# Altium schematic sheet Sheet1.SchDoc
size A; SheetNumber: 1; SheetTotal: 1
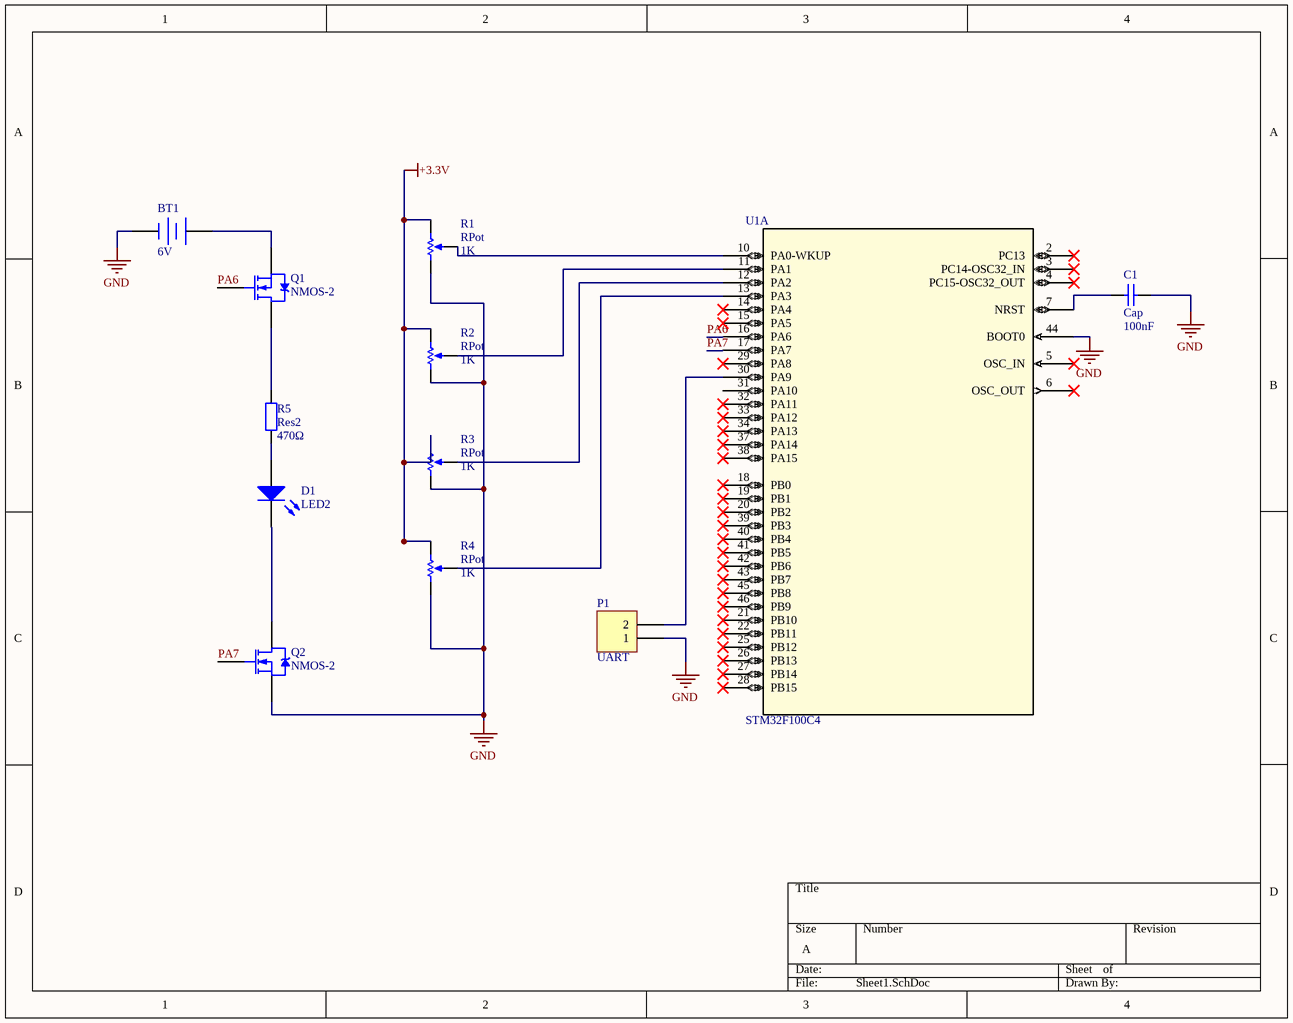
[diagram p0: Sheet1.SchDoc]

## Parts
BT1  6V  [BAT-2]
C1  Cap  value 100nF  [RAD-0.3]
D1  LED2  [3.2X1.6X1.1]
P1  UART  [HDR1X2]
Q1  NMOS-2  [TO-220AB]
Q2  NMOS-2  [TO-220AB]
R1  RPot  value 1K  [VR5]
R2  RPot  value 1K  [VR5]
R3  RPot  value 1K  [VR5]
R4  RPot  value 1K  [VR5]
R5  Res2  value 470Ω  [AXIAL-0.4]
U1  STM32F100C4  [LQFP48-7x7mm]  (part A of 2)

## Nets
+3.3V: R1.2(BOT) R2.2(BOT) R3.2(BOT) R4.2(BOT)
GND: BT1.2(-) C1.2 P1.1 Q2.3(S) R1.1(TOP) R2.1(TOP) R3.1(TOP) R4.1(TOP) U1.44(BOOT0)
PA6: Q1.1(G) U1.16(PA6)
PA7: Q2.1(G) U1.17(PA7)
NetBT1_1: BT1.1(+) Q1.3(S)
NetC1_1: C1.1 U1.7(NRST)
NetD1_1: D1.1(A) R5.1
NetD1_2: D1.2(K) Q2.2(D)
NetP1_2: P1.2 U1.30(PA9)
NetQ1_2: Q1.2(D) R5.2
NetR1_3: R1.3(TAP) U1.10(PA0-WKUP)
NetR2_3: R2.3(TAP) U1.11(PA1)
NetR3_3: R3.3(TAP) U1.12(PA2)
NetR4_3: R4.3(TAP) U1.13(PA3)

Not connected (* = marked no-connect by the designer): U1 2(PC13)* 3(PC14-OSC32_IN)* 4(PC15-OSC32_OUT)* 5(OSC_IN)* 6(OSC_OUT)* 14(PA4)* 15(PA5)* 18(PB0)* 19(PB1)* 20(PB2)* 21(PB10)* 22(PB11)* 25(PB12)* 26(PB13)* 27(PB14)* 28(PB15)* 29(PA8)* 31(PA10) 32(PA11)* 33(PA12)* 34(PA13)* 37(PA14)* 38(PA15)* 39(PB3)* 40(PB4)* 41(PB5)* 42(PB6)* 43(PB7)* 45(PB8)* 46(PB9)*

## Library data of the parts
BT1 = Battery: Multicell Battery; Published: 24-Mar-1999; LatestRevisionDate: 17-Jul-2002; LatestRevisionNote: Re-released for DXP Platform.; PackageReference: BAT-2; Publisher: Altium Limited; PackageDescription: Battery; 2 Leads
C1 = Cap: Capacitor; Published: 8-Jun-2000; LatestRevisionDate: 17-Jul-2002; LatestRevisionNote: Re-released for DXP Platform.; PackageReference: RAD-0.3; Publisher: Altium Limited; PackageDescription: Radial Cap, Thru-Hole; 2 Leads; 0.3 in Pin Spacing
D1 = LED2: Typical RED, GREEN, YELLOW, AMBER GaAs LED; Published: 8-Jun-2000; LatestRevisionDate: 17-Jul-2002; LatestRevisionNote: Re-released for DXP Platform.; PackageVersion: Feb-2002; PackageReference: 3.2X1.6X1.1; Publisher: Altium Limited; PackageDescription: SM LED; 2 Flat Leads
P1 = Header 2: Header, 2-Pin; LatestRevisionDate: 17-Jul-2002; LatestRevisionNote: Re-released for DXP Platform.; Publisher: Altium Limited
Q1 Q2 = NMOS-2: N-Channel Power MOSFET; Note: Pin 2 is electrically connected to pin 4.; Published: 8-Jun-2000; LatestRevisionDate: 17-Jul-2002; LatestRevisionNote: Re-released for DXP Platform.; DatasheetVersion: PD-9.814; PackageVersion: Feb-1997; PackageReference: TO-220AB; Publisher: Altium Limited; PackageDescription: TO, Thru-Hole, Vertical, Heatsink Mounted; 3 In-Line Leads; Pitch 2.54 mm; ComponentLink1Description: Manufacturer Link; ComponentLink1URL: http://www.irf.com/
R1-R4 = RPot: Potentiometer; Sim Note: Enter the Resistance value and the set point into parameter fields.; Set Position: 0.5; Published: 8-Jun-2000; LatestRevisionDate: 17-Jul-2002; LatestRevisionNote: Re-released for DXP Platform.; PackageReference: VR5; Publisher: Altium Limited; PackageDescription: Variable Resistor, Thru-Hole; 3 Leads
R5 = Res2: Resistor; Published: 8-Jun-2000; LatestRevisionDate: 17-Jul-2002; LatestRevisionNote: Re-released for DXP Platform.; PackageReference: AXIAL-0.4; Publisher: Altium Limited; PackageDescription: Axial Device, Thru-Hole; 2 Leads; 0.4 in Pin Spacing
U1 = STM32F100C4T6B: Mainstream Value line, Arm Cortex-M3 MCU with 16 Kbytes of Flash memory, 24 MHz CPU, motor control and CEC functions; Manufacturer_Name: STMicroelectronics; Copyright: Copyright (C) 2025 Ultra Librarian. All rights reserved.; Manufacturer_Part_Number: STM32F100C4T6B; RefDes: RefDes; Type: Type